# EasyEDA Pro project ProPrj_OASman SMD update_2025-02-10.epro

# Schematic Schematic1
Board Name: Board1; Create Date: 2025-02-08; Page Name: P1; Project Name: ProDoc_OASmanPCB_2025-02-07; Schematic Name: Schematic1; Update Date: 2025-02-07; Company: EasyEDA.com; Page Size: A4; Version: V1.0
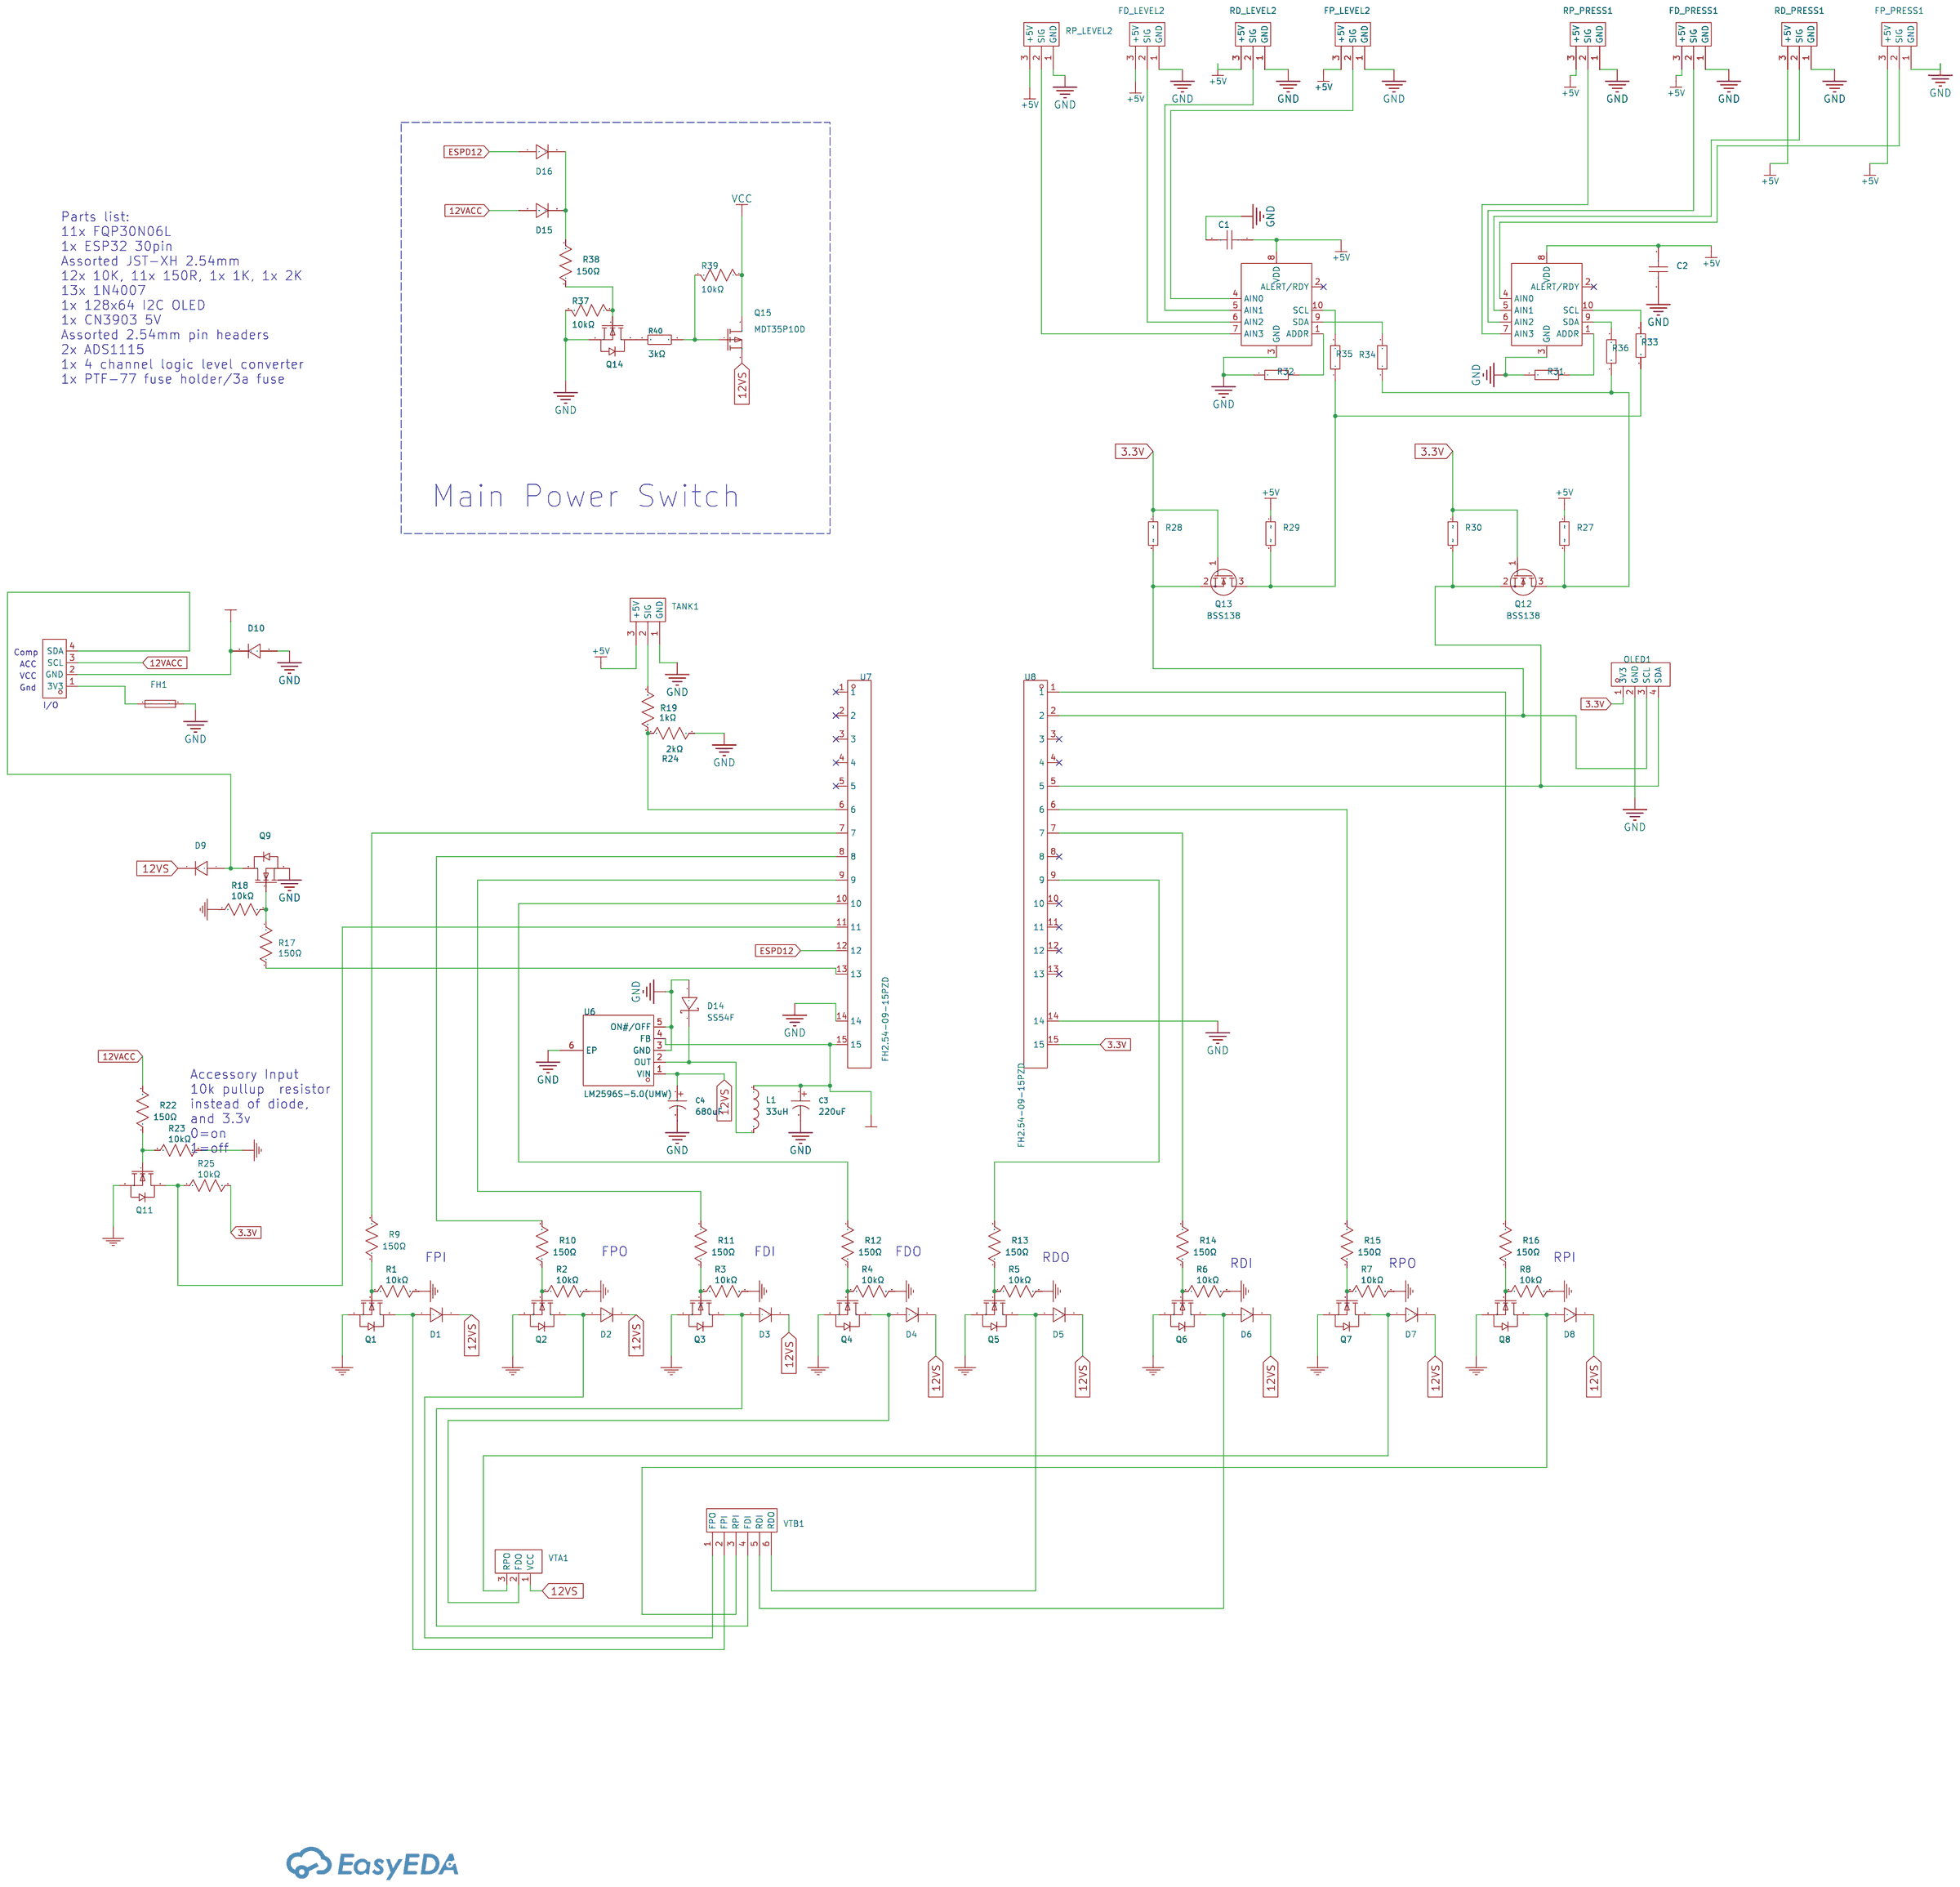
[diagram p0: schematic sheet]

## Parts
C1  1uF  [C0603]
C2  1uF  [C0603]
C3  220uF  [CAP-SMD_BD6.3-L6.6-W6.6-FD]
C4  680uF  [CAP-SMD_BD10.0-L10.3-W10.3-LS11.3-FD]
CN1  XH-4A绿色  [CONN-TH_XH-4A-1]
D1  1N4007  [SMA_L4.3-W2.5-LS5.0-RD]
D2  1N4007  [SMA_L4.3-W2.5-LS5.0-RD]
D3  1N4007  [SMA_L4.3-W2.5-LS5.0-RD]
D4  1N4007  [SMA_L4.3-W2.5-LS5.0-RD]
D5  1N4007  [SMA_L4.3-W2.5-LS5.0-RD]
D6  1N4007  [SMA_L4.3-W2.5-LS5.0-RD]
D7  1N4007  [SMA_L4.3-W2.5-LS5.0-RD]
D8  1N4007  [SMA_L4.3-W2.5-LS5.0-RD]
D9  1N4007  [SMA_L4.3-W2.5-LS5.0-RD]
D10  1N4007  [SMA_L4.3-W2.5-LS5.0-RD]
D14  SS54F  [SMAF_L3.5-W2.6-LS4.7-FD]
D15  1N4007  [SMA_L4.3-W2.5-LS5.0-RD]
D16  1N4007  [SMA_L4.3-W2.5-LS5.0-RD]
FD_LEVEL2  XH-3A  [CONN-TH_XH-3A]
FD_PRESS1  XH-3A  [CONN-TH_XH-3A]
FH1  PTF-77  [FUSE-TH_L24.4-W9.4-P22.60]
FP_LEVEL2  XH-3A  [CONN-TH_XH-3A]
FP_PRESS1  XH-3A  [CONN-TH_XH-3A]
L1  33uH  [IND-SMD_L10.8-W10.0_SLO1040H]
OLED1  XH-4A绿色  [CONN-TH_XH-4A-1]
Q1  MDT30N06L  [TO-252-2_L6.6-W5.6-P4.60-LS9.7-BR]
Q2  MDT30N06L  [TO-252-2_L6.6-W5.6-P4.60-LS9.7-BR]
Q3  MDT30N06L  [TO-252-2_L6.6-W5.6-P4.60-LS9.7-BR]
Q4  MDT30N06L  [TO-252-2_L6.6-W5.6-P4.60-LS9.7-BR]
Q5  MDT30N06L  [TO-252-2_L6.6-W5.6-P4.60-LS9.7-BR]
Q6  MDT30N06L  [TO-252-2_L6.6-W5.6-P4.60-LS9.7-BR]
Q7  MDT30N06L  [TO-252-2_L6.6-W5.6-P4.60-LS9.7-BR]
Q8  MDT30N06L  [TO-252-2_L6.6-W5.6-P4.60-LS9.7-BR]
Q9  MDT30N06L  [TO-252-2_L6.6-W5.6-P4.60-LS9.7-BR]
Q11  MDT30N06L  [TO-252-2_L6.6-W5.6-P4.60-LS9.7-BR]
Q12  BSS138  [PCM_Package_TO_SOT_SMD_AKL:SOT-23]
Q13  BSS138  [PCM_Package_TO_SOT_SMD_AKL:SOT-23]
Q14  MDT30N06L  [TO-252-2_L6.6-W5.6-P4.60-LS9.7-BR]
Q15  MDT35P10D  [TO-252-2_L6.6-W6.1-P4.57-LS9.9-BR-CW]
R1  10kΩ  [R1206]
R2  10kΩ  [R1206]
R3  10kΩ  [R1206]
R4  10kΩ  [R1206]
R5  10kΩ  [R1206]
R6  10kΩ  [R1206]
R7  10kΩ  [R1206]
R8  10kΩ  [R1206]
R9  150Ω  [R1206]
R10  150Ω  [R1206]
R11  150Ω  [R1206]
R12  150Ω  [R1206]
R13  150Ω  [R1206]
R14  150Ω  [R1206]
R15  150Ω  [R1206]
R16  150Ω  [R1206]
R17  150Ω  [R1206]
R18  10kΩ  [R1206]
R19  1kΩ  [R1206]
R22  150Ω  [R1206]
R23  10kΩ  [R1206]
R24  2kΩ  [R1206]
R25  10kΩ  [R1206]
R27  10k_0402  [Resistor_SMD:R_0402_1005Metric]
R28  10k_0402  [Resistor_SMD:R_0402_1005Metric]
R29  10k_0402  [Resistor_SMD:R_0402_1005Metric]
R30  10k_0402  [Resistor_SMD:R_0402_1005Metric]
R31  10K  [R0402]
R32  10K  [R0402]
R33  10K  [R0402]
R34  10K  [R0402]
R35  10K  [R0402]
R36  10K  [R0402]
R37  10kΩ  [R1206]
R38  150Ω  [R1206]
R39  10kΩ  [R1206]
R40  3kΩ  [R1206]
RD_LEVEL2  XH-3A  [CONN-TH_XH-3A]
RD_PRESS1  XH-3A  [CONN-TH_XH-3A]
RP_LEVEL2  XH-3A  [CONN-TH_XH-3A]
RP_PRESS1  XH-3A  [CONN-TH_XH-3A]
TANK1  XH-3A  [CONN-TH_XH-3A]
U4  ADS1115IDGSR  [MSOP-10_L3.0-W3.0-P0.50-LS5.0-BL]
U5  ADS1115IDGSR  [MSOP-10_L3.0-W3.0-P0.50-LS5.0-BL]
U6  LM2596S-5.0(UMW)  [TO-263-5_L10.2-W8.9-P1.70-BR]
U7  FH2.54-09-15PZD  [HDR-TH_15P-P2.54-V-F-1]
U8  FH2.54-09-15PZD  [HDR-TH_15P-P2.54-V-F-1]
VTA1  XH-3A  [CONN-TH_XH-3A]
VTB1  XH-6A  [CONN-TH_6P-P2.50_XH-6A]

## Library data of the parts
C1 C2 = GRM188R61H105KAALD: Capacitance: Tolerance:±10% Tolerance:±10% Voltage Rated: Temperature Coefficient:; LCSC Part Name: 1uF ±10% 50V; Supplier Part: C77386; Manufacturer: muRata(村田); Supplier Footprint: 0603; JLCPCB Part Class: Extended Part; Datasheet: https://atta.szlcsc.com/upload/public/pdf/source/20170116/1484561238855.pdf; Supplier: LCSC; Tolerance: ±10%
C3 = CK1C221M-CRE77: Capacitance: Tolerance:±20% Tolerance:±20% Rated Voltage: Ripple Current:- Equivalent Series Resistance(ESR):- φD: L: Lifetime @ Temp:2000hrs@105℃ Operating Temperature:-40℃~+105℃ Operating Temperature:-40℃~+105℃; LCSC Part Name: 220uF ±20% 16V; Supplier Part: C131158; Manufacturer: ST(先科); Supplier Footprint: SMD,D6.3xL7.7mm; JLCPCB Part Class: Extended Part; Datasheet: https://atta.szlcsc.com/upload/public/pdf/source/20180511/C191812_AFB6060B7C8A92684C0DBB73273612B6.pdf; Supplier: LCSC; Tolerance: ±20%; Lifetime @ Temp: 2000hrs@105℃; Operating Temperature: -40℃~+105℃
C4 = VT1E681M1013: Capacitance: Tolerance:±20% Tolerance:±20% Rated Voltage: Ripple Current:- Equivalent Series Resistance(ESR):- φD: L: Lifetime @ Temp:2000hrs@105℃ Operating Temperature:-40℃~+105℃ Operating Temperature:-40℃~+105℃; LCSC Part Name: 680uF ±20% 25V; Supplier Part: C50456; Manufacturer: HONOR(荣誉); JLCPCB Part Class: Extended Part; Datasheet: https://atta.szlcsc.com/upload/public/pdf/source/20210105/C50456_AB267C092744AC1CDEAFE23B9B6DBFA0.pdf; Supplier: LCSC; Tolerance: ±20%; Lifetime @ Temp: 2000hrs@105℃; Operating Temperature: -40℃~+105℃
CN1 OLED1 = XH-4A绿色: Pins Structure:1x4P Pitch:- Mounting Style:- Reference Series:XH Number of Pins:4P Number of Rows:1 Number of PINs Per Row:4 Row Spacing:- Contact Material:-; LCSC Part Name: 1x4P 系列:XH; Supplier Part: C192885; Manufacturer: BOOMELE(博穆精密); Supplier Footprint: 插件,P=2.5mm; JLCPCB Part Class: Extended Part; Supplier: LCSC; Pins Structure: 1x4P; Reference Series: XH; Number of Pins: 4P; Number of Rows: 1; Number of PINs Per Row: 4
D1-D10 D15 D16 = 1N4007_C727081: Diode Configuration:Independent Type Forward Voltage (Vf@If):1.1V@1A Reverse Voltage (Vr): Rectified Current: Reverse Leakage Current (Ir):5uA; Supplier Part: C727081; Manufacturer: TWGMC(台湾迪嘉); Supplier Footprint: SMA(DO-214AC); JLCPCB Part Class: Extended Part; Datasheet: https://atta.szlcsc.com/upload/public/pdf/source/20200828/C727079_3A05254382567072883400655AE0ED46.pdf; Supplier: LCSC; Diode Configuration: Independent Type; Forward Voltage (Vf@If): 1.1V@1A; Reverse Leakage Current (Ir): 5uA
D14 = SS54F_C524830: Diode Configuration:Single Forward Voltage (Vf@If):550mV@5A Reverse Voltage (Vr):40V Average Rectified Current (Io):5A Reverse Leakage Current (Ir):500uA@40V; LCSC Part Name: 电压:40V 电流:5A; Supplier Part: C524830; Manufacturer: High Diode(海德); Supplier Footprint: SMAF; JLCPCB Part Class: Extended Part; Datasheet: https://atta.szlcsc.com/upload/public/pdf/source/20191203/C466492_9442A9360C1C4CFA388C0BFD5F2F9ABE.pdf; Supplier: LCSC; Diode Configuration: Single; Forward Voltage (Vf@If): 550mV@5A; Reverse Voltage (Vr): 40V; Average Rectified Current (Io): 5A; Reverse Leakage Current (Ir): 500uA@40V
FD_LEVEL2 FD_PRESS1 FP_LEVEL2 FP_PRESS1 RD_LEVEL2 RD_PRESS1 RP_LEVEL2 RP_PRESS1 TANK1 VTA1 = XH-3A_C2316: Pins Structure:1x3P Pitch:2.5mm Mounting Style:- Reference Series:XH Number of Pins:3P Number of Rows:1 Number of PINs Per Row:3 Row Spacing:- Contact Material:-; LCSC Part Name: 1x3P 间距:2.5mm 系列:XH; Supplier Part: C2316; Manufacturer: BOOMELE(博穆精密); Supplier Footprint: 插件,P=2.5mm; JLCPCB Part Class: Extended Part; Datasheet: https://atta.szlcsc.com/upload/public/pdf/source/20151222/1457707654251.pdf; Supplier: LCSC; Pins Structure: 1x3P; Pitch: 2.5mm; Reference Series: XH; Number of Pins: 3P; Number of Rows: 1; Number of PINs Per Row: 3
FH1 = PTF-77: Fuseholder Type:- Voltage Rating:250V Current Rating:10A Fuse Type:- Fuse Size:-; LCSC Part Name: 保险丝座 5x20mm 绿色 2件套; Supplier Part: C717030; Manufacturer: XFCN(兴飞); JLCPCB Part Class: Extended Part; Datasheet: https://atta.szlcsc.com/upload/public/pdf/source/20241204/2C5BCE3FA349D3ADCF55CB0838B92C4A.pdf; Supplier: LCSC; Voltage Rating: 250V; Current Rating: 10A
L1 = SLO1040H330MTT: Inductance: Tolerance:±20% Tolerance:±20% Rated Current: DC Resistance (DCR):; LCSC Part Name: 33uH ±20%; Supplier Part: C182163; Manufacturer: Sunltech(韩国顺磁); Supplier Footprint: SMD; JLCPCB Part Class: Extended Part; Datasheet: https://atta.szlcsc.com/upload/public/pdf/source/20201009/C207854_ACA4210DD273ACBB198904FC5A3A8806.pdf; Supplier: LCSC; Tolerance: ±20%
Q1-Q9 Q11 Q14 = MDT30N06L: Type:1 N-channel Drain Source Voltage (Vdss):60V Continuous Drain Current (Id): Drain Source On Resistance (RDS(on)@Vgs,Id):40mΩ@4.5V Power Dissipation (Pd): Gate Threshold Voltage (Vgs(th)@Id):1.8V@250uA Total Gate Charge (Qg@Vgs):21nC@10V Input Capacita; LCSC Part Name: 1个N沟道 耐压:60V 电流:30A; Supplier Part: C5240683; Manufacturer: minos(迈诺斯); Supplier Footprint: TO-252-2L; JLCPCB Part Class: Extended Part; Datasheet: https://atta.szlcsc.com/upload/public/pdf/source/20240829/EA64E09E95BF58FCAC7BF20D9AEBC519.pdf; Supplier: LCSC; Type: 1 N-channel; Drain Source Voltage (Vdss): 60V; Drain Source On Resistance (RDS(on)@Vgs,Id): 40mΩ@4.5V; Gate Threshold Voltage (Vgs(th)@Id): 1.8V@250uA; Total Gate Charge (Qg@Vgs): 21nC@10V; Input Capacitance (Ciss@Vds): 670pF; Reverse Transfer Capacitance (Crss@Vds): 66pF; Operating Temperature: -55℃~+175℃
Q12 Q13 = PCM_Transistor_MOSFET_AKL_BSS138: SOT-23 N-MOSFET enchancement mode transistor, 50V, 200mA, 300mW, Alternate KiCAD Library; User doc link: https://www.tme.eu/Document/2b32cdd3c66afedbcd628e73d93ae817/BSS138-7-F.pdf
Q15 = MDT35P10D: Type:1 Piece P-Channel Drain Source Voltage (Vdss): Continuous Drain Current (Id): Drain Source On Resistance (RDS(on)@Vgs,Id):26mΩ@10V,15A Power Dissipation (Pd): Gate Threshold Voltage (Vgs(th)@Id):2V@250uA Total Gate Charge (Qg@Vgs):40nC@10V Input Capa; LCSC Part Name: 1个P沟道 耐压:100V 电流:35A; Supplier Part: C5890267; Manufacturer: minos(迈诺斯); Supplier Footprint: TO252; JLCPCB Part Class: Extended Part; Datasheet: https://atta.szlcsc.com/upload/public/pdf/source/20230704/A90682651C9529CA52851179CB8911E0.pdf; Supplier: LCSC; Type: 1 Piece P-Channel; Drain Source On Resistance (RDS(on)@Vgs,Id): 26mΩ@10V,15A; Gate Threshold Voltage (Vgs(th)@Id): 2V@250uA; Total Gate Charge (Qg@Vgs): 40nC@10V; Input Capacitance (Ciss@Vds): 2.315nF@25V; Reverse Transfer Capacitance (Crss@Vds): 11pF@25V
R1-R8 R18 R23 R25 R37 R39 = 1206W4F1002T5E: Type:Thick Film Resistors Resistance:10kΩ Tolerance:±1% Tolerance:±1% Power(Watts): Overload Voltage (Max): Temperature Coefficient:±100ppm/℃ Temperature Coefficient:±100ppm/℃ Operating Temperature Range:-55℃~+155℃ Operating Temperature Range:-55℃~+155℃; LCSC Part Name: 10kΩ ±1% 250mW 厚膜电阻; Supplier Part: C17902; Manufacturer: UNI-ROYAL(厚声); Supplier Footprint: 1206; JLCPCB Part Class: Basic Part; Datasheet: https://atta.szlcsc.com/upload/public/pdf/source/20200306/C422600_1E6D84923E4A46A82E41ADD87F860B5C.pdf; Supplier: LCSC; Type: Thick Film Resistors; Tolerance: ±1%; Temperature Coefficient: ±100ppm/℃; Operating Temperature Range: -55℃~+155℃
R9-R17 R22 R38 = 1206W4F1500T5E: Type:Thick Film Resistors Resistance: Tolerance:±1% Tolerance:±1% Power(Watts): Overload Voltage (Max): Temperature Coefficient:±100ppm/℃ Temperature Coefficient:±100ppm/℃ Operating Temperature Range:-55℃~+155℃ Operating Temperature Range:-55℃~+155℃; LCSC Part Name: 150Ω ±1% 250mW 厚膜电阻; Supplier Part: C17917; Manufacturer: UNI-ROYAL(厚声); Supplier Footprint: 1206; JLCPCB Part Class: Extended Part; Datasheet: https://atta.szlcsc.com/upload/public/pdf/source/20200306/C422600_1E6D84923E4A46A82E41ADD87F860B5C.pdf; Supplier: LCSC; Type: Thick Film Resistors; Tolerance: ±1%; Temperature Coefficient: ±100ppm/℃; Operating Temperature Range: -55℃~+155℃
R19 = 1206W4F1001T5E_C4410: Type:Thick Film Resistors Resistance:1kΩ Tolerance:±1% Tolerance:±1% Power(Watts): Overload Voltage (Max): Operating Temperature Range:-55℃~+155℃ Operating Temperature Range:-55℃~+155℃; LCSC Part Name: 1kΩ ±1% 250mW 厚膜电阻; Supplier Part: C4410; Manufacturer: UNI-ROYAL(厚声); Manufacturer Part: 1206W4F1001T5E; Supplier Footprint: 1206; JLCPCB Part Class: Basic Part; Datasheet: https://atta.szlcsc.com/upload/public/pdf/source/20200306/C422600_1E6D84923E4A46A82E41ADD87F860B5C.pdf; Supplier: LCSC; Type: Thick Film Resistors; Tolerance: ±1%; Operating Temperature Range: -55℃~+155℃
R24 = 1206W4F2001T5E: Type:Thick Film Resistors Resistance:2kΩ Tolerance:±1% Tolerance:±1% Power(Watts): Overload Voltage (Max): Temperature Coefficient:±100ppm/℃ Temperature Coefficient:±100ppm/℃ Operating Temperature Range:-55℃~+155℃ Operating Temperature Range:-55℃~+155℃; LCSC Part Name: 2kΩ ±1% 250mW 厚膜电阻; Supplier Part: C17944; Manufacturer: UNI-ROYAL(厚声); Supplier Footprint: 1206; JLCPCB Part Class: Basic Part; Datasheet: https://atta.szlcsc.com/upload/public/pdf/source/20200306/C422600_1E6D84923E4A46A82E41ADD87F860B5C.pdf; Supplier: LCSC; Type: Thick Film Resistors; Tolerance: ±1%; Temperature Coefficient: ±100ppm/℃; Operating Temperature Range: -55℃~+155℃
R27-R30 = PCM_4ms_Resistor_10k_0402: 10k, 1%, 1/16W, 0603; Specifications: 10k, 1%, 1/10W, 0402; Manufacturer: Yageo; Part Number: RT0402FRE0710KL; Display: 10k; Manufacturer 2: Yageo; Part Number 2: RT0402DRE0710KL
R31-R36 = Res_0402: Supplier Footprint: 0402
R40 = 1206W4F3001T5E: Type:Thick Film Resistors Resistance:3kΩ Tolerance:±1% Tolerance:±1% Power(Watts): Overload Voltage (Max): Temperature Coefficient:±100ppm/℃ Temperature Coefficient:±100ppm/℃ Operating Temperature Range:-55℃~+155℃ Operating Temperature Range:-55℃~+155℃; LCSC Part Name: 3kΩ ±1% 250mW 厚膜电阻; Supplier Part: C18012; Manufacturer: UNI-ROYAL(厚声); Supplier Footprint: 1206; JLCPCB Part Class: Extended Part; Datasheet: https://atta.szlcsc.com/upload/public/pdf/source/20200306/C422600_1E6D84923E4A46A82E41ADD87F860B5C.pdf; Supplier: LCSC; Type: Thick Film Resistors; Tolerance: ±1%; Temperature Coefficient: ±100ppm/℃; Operating Temperature Range: -55℃~+155℃
U4 U5 = ADS1115IDGSR: Interface:I2C differential input:Yes number of channels:2 Supply Voltage:2V~5.5V Supply Voltage:2V~5.5V sampling frequency:860Hz resolution:16Bit Operating Temperature:-40℃~+125℃ Operating Temperature:-40℃~+125℃; LCSC Part Name: 具有内部基准、振荡器和可编程比较器且兼容 I2C 的ADS111x、超小型、低功耗 860SPS、16位ADC; Supplier Part: C37593; Manufacturer: TI(德州仪器); Supplier Footprint: VSSOP-10; JLCPCB Part Class: Extended Part; Datasheet: https://www.ti.com/cn/lit/gpn/ads1115; Supplier: LCSC; Interface: I2C; differential input: Yes; number of channels: 2; Supply Voltage: 2V~5.5V; sampling frequency: 860Hz; resolution: 16Bit; Operating Temperature: -40℃~+125℃
U6 = LM2596S-5.0(UMW): Function:Step-down type Output Type:Fixed Input Voltage:7V~40V Input Voltage:7V~40V Output Voltage:5V Output Voltage:5V Output Current:3A Switching Frequency:150kHz Switching Frequency:150kHz Operating Temperature:-40℃~+125℃@(TA) Operating Temperature:-40; LCSC Part Name: 3A降压稳压器; Supplier Part: C347421; Manufacturer: UMW(友台半导体); Supplier Footprint: TO-263-5; JLCPCB Part Class: Extended Part; Datasheet: https://atta.szlcsc.com/upload/public/pdf/source/20241113/7515F50B4FEE0270D4DE7078364C87FA.pdf; Supplier: LCSC; Function: Step-down type; Output Type: Fixed; Input Voltage: 7V~40V; Output Voltage: 5V; Output Current: 3A; Switching Frequency: 150kHz; Operating Temperature: -40℃~+125℃@(TA); Synchronous Rectification: No; Number of Outputs: 1; Topology: Step-down; Quiescent Current (Iq): 80uA; Switch tube (built-in/external): Built-in
U7 U8 = FH2.54-09-15PZD: Supplier Part: C7500782; Manufacturer: XUNPU(讯普); Supplier Footprint: 插件,P=2.54mm; JLCPCB Part Class: Extended Part; Datasheet: https://atta.szlcsc.com/upload/public/pdf/source/20230809/12C46BEDB70740F4680EB1129D481D12.pdf; Supplier: LCSC
VTB1 = XH-6A_C5663: Pins Structure:1x6P Pitch:2.5mm Mounting Style:- Reference Series:XH Number of Pins:6P Number of Rows:1 Number of PINs Per Row:6 Row Spacing:- Contact Material:-; LCSC Part Name: 系列:XH 间距:2.5mm 1x6P; Supplier Part: C5663; Manufacturer: BOOMELE(博穆精密); Supplier Footprint: 插件,P=2.5mm; JLCPCB Part Class: Extended Part; Datasheet: https://atta.szlcsc.com/upload/public/pdf/source/20151222/1457707654251.pdf; Supplier: LCSC; Pins Structure: 1x6P; Pitch: 2.5mm; Reference Series: XH; Number of Pins: 6P; Number of Rows: 1; Number of PINs Per Row: 6

## Nets
3.3V: OLED1.1(3V3) Q12.1(G) Q13.1(G) R25.2 R28.1 R30.1 U8.15
12VACC: CN1.3(SCL) D15.1(A) R22.2
12VS: C4.1 D1.2(K) D2.2(K) D3.2(K) D4.2(K) D5.2(K) D6.2(K) D7.2(K) D8.2(K) D9.2(K) Q15.3(S) U6.1(VIN) VTA1.1(VCC)
+5V: C1.1 C2.1 C3.1 FD_LEVEL2.3(+5V) FD_PRESS1.3(+5V) FP_LEVEL2.3(+5V) FP_PRESS1.3(+5V) L1.1 R27.1 R29.1 RD_LEVEL2.3(+5V) RD_PRESS1.3(+5V) RP_LEVEL2.3(+5V) RP_PRESS1.3(+5V) TANK1.3(+5V) U4.8(VDD) U5.8(VDD) U6.4(FB) U7.15
GND: C1.2 C2.2 C3.2 C4.2 D10.1(A) D14.1(A) FD_LEVEL2.1(GND) FD_PRESS1.1(GND) FH1.2 FP_LEVEL2.1(GND) FP_PRESS1.1(GND) OLED1.2(GND) Q1.3(S) Q2.3(S) Q3.3(S) Q4.3(S) Q5.3(S) Q6.3(S) Q7.3(S) Q8.3(S) Q9.3(S) Q11.3(S) Q14.3(S) R1.2 R2.2 R3.2 R4.2 R5.2 R6.2 R7.2 R8.2 R18.2 R23.2 R24.1 R31.1 R32.1 R37.2 RD_LEVEL2.1(GND) RD_PRESS1.1(GND) RP_LEVEL2.1(GND) RP_PRESS1.1(GND) TANK1.1(GND) U4.3(GND) U5.3(GND) U6.3(GND) U6.5(ON#/OFF) U6.6(EP) U7.14 U8.14
VCC: CN1.2(GND) D10.2(K) Q15.2(D) R39.1
ESPD12: D16.1(A) U7.12
$1N4350: Q8.1(G) R8.1 R16.1
$1N4351: Q7.1(G) R7.1 R15.1
$1N4352: Q6.1(G) R6.1 R14.1
$1N4353: Q5.1(G) R5.1 R13.1
$1N4354: Q4.1(G) R4.1 R12.1
$1N4355: Q3.1(G) R3.1 R11.1
$1N4356: Q2.1(G) R2.1 R10.1
$1N4357: Q1.1(G) R1.1 R9.1
$1N4371: D4.1(A) Q4.2(D) VTA1.2(FDO)
$1N4376: Q9.1(G) R17.1 R18.1
$1N4377: R10.2 U7.8
$1N4378: R11.2 U7.9
$1N4379: CN1.4(SDA) D9.1(A) Q9.2(D)
$1N4380: R13.2 U8.9
$1N4381: R14.2 U8.7
$1N4382: R19.2 TANK1.2(SIG)
$1N4383: R19.1 R24.2 U7.6
$1N4386: CN1.1(3V3) FH1.1
$1N4403: FD_LEVEL2.2(SIG) U4.6(AIN2)
$1N4407: FP_LEVEL2.2(SIG) U4.4(AIN0)
$1N4413: RD_LEVEL2.2(SIG) U4.5(AIN1)
$1N4416: RD_PRESS1.2(SIG) U5.5(AIN1)
$1N4423: RP_LEVEL2.2(SIG) U4.7(AIN3)
$1N4424: FD_PRESS1.2(SIG) U5.6(AIN2)
$1N4428: RP_PRESS1.2(SIG) U5.7(AIN3)
$1N4434: Q11.2(D) R25.1 U7.11
$1N4435: R17.2 U7.13
$1N4436: R16.2 U8.1
$1N4438: R9.2 U7.7
$1N4442: R15.2 U8.6
$1N4443: FP_PRESS1.2(SIG) U5.4(AIN0)
$1N4444: R31.2 U5.1(ADDR)
$1N4446: R32.2 U4.1(ADDR)
$1N4448: R33.2 U5.10(SCL)
$1N4449: R34.2 U4.9(SDA)
$1N4451: R35.2 U4.10(SCL)
$1N4452: R36.2 U5.9(SDA)
$1N4455: Q11.1(G) R22.1 R23.1
$1N4460: R12.2 U7.10
$1N4462: D14.2(K) L1.2 U6.2(OUT)
$1N4475: Q14.2(D) R40.1
$1N4476: Q15.1(G) R39.2 R40.2
$1N4478: Q14.1(G) R37.1 R38.1
$1N4479: D15.2(K) D16.2(K) R38.2
$1N4481: D7.1(A) Q7.2(D) VTA1.3(RPO)
Net-(D1-1): D1.1(A) Q1.2(D) VTB1.2(FPI)
Net-(D2-1): D2.1(A) Q2.2(D) VTB1.1(FPO)
Net-(D3-1): D3.1(A) Q3.2(D) VTB1.4(FDI)
Net-(D5-1): D5.1(A) Q5.2(D) VTB1.6(RDO)
Net-(D6-1): D6.1(A) Q6.2(D) VTB1.5(RDI)
Net-(D8-1): D8.1(A) Q8.2(D) VTB1.3(RPI)
Net-(OLED1-3): OLED1.3(SCL) Q13.2(S) R28.2 U8.2
Net-(OLED1-4): OLED1.4(SDA) Q12.2(S) R30.2 U8.5
Net-(Q12-3): Q12.3(D) R27.2 R34.1 R36.1
Net-(Q13-3): Q13.3(D) R29.2 R33.1 R35.1

Not connected (* = marked no-connect by the designer): U4 2(ALERT/RDY)*; U5 2(ALERT/RDY)*; U7 1* 2* 3* 4* 5*; U8 3* 4* 8* 10* 11* 12* 13*

## Notes on the sheet
- Parts list:
  11x FQP30N06L
  1x ESP32 30pin
  Assorted JST-XH 2.54mm
  12x 10K, 11x 150R, 1x 1K, 1x 2K
  13x 1N4007
  1x 128x64 I2C OLED
  1x CN3903 5V
  Assorted 2.54mm pin headers
  2x ADS1115
  1x 4 channel logic level converter
  1x PTF-77 fuse holder/3a fuse
- Main Power Switch
- Comp
- ACC
- VCC
- Gnd
- I/O
- Accessory Input
  10k pullup  resistor
  instead of diode,
  and 3.3v
  0=on
  1=off
- FPI
- FPO
- FDI
- FDO
- RDO
- RPI
- RDI
- RPO

# Board PCB1
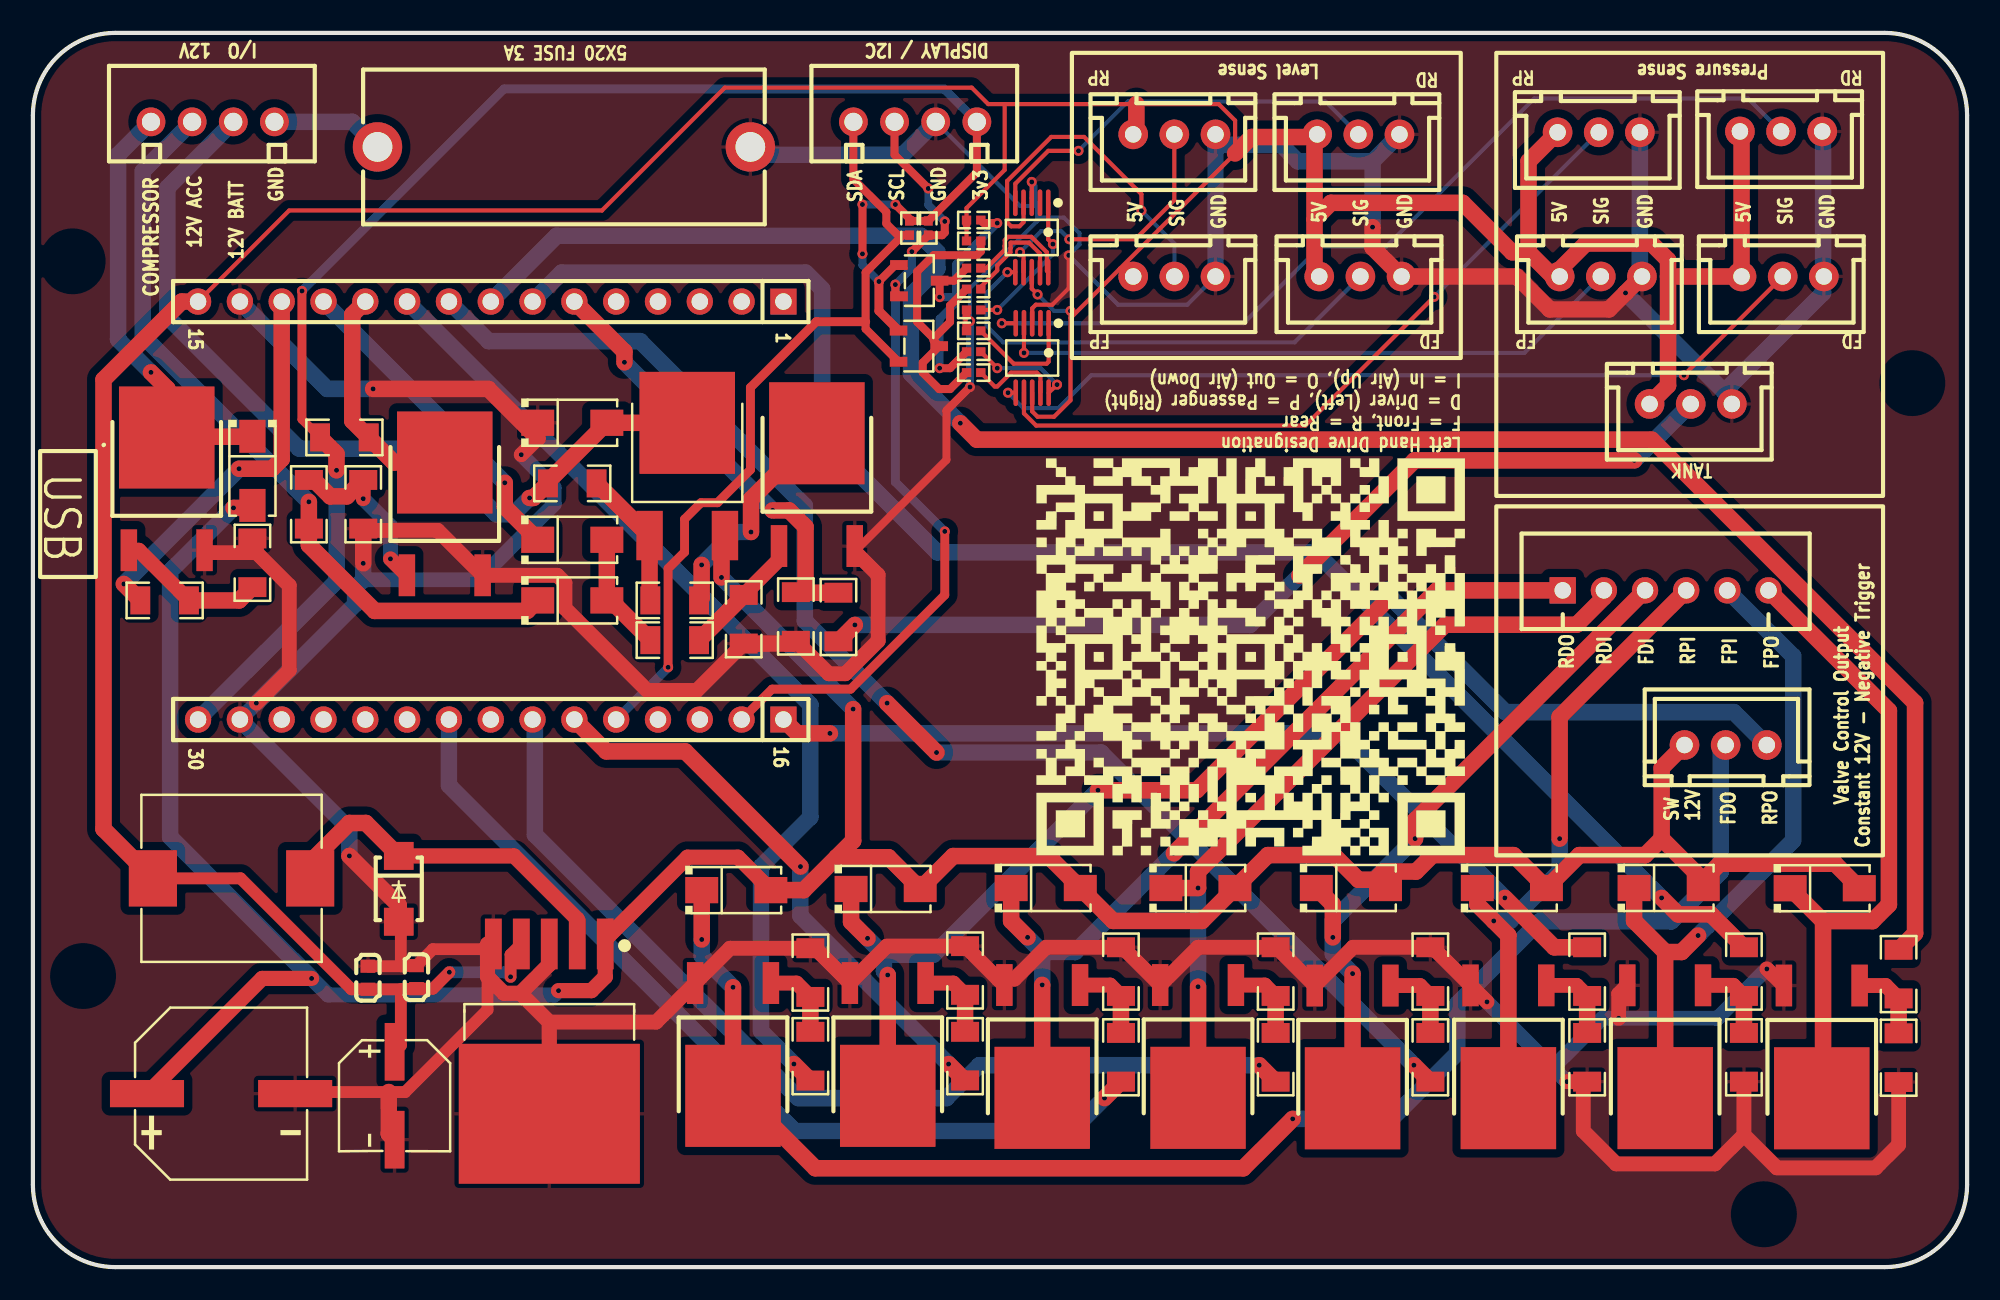
[diagram p1: board, top side]
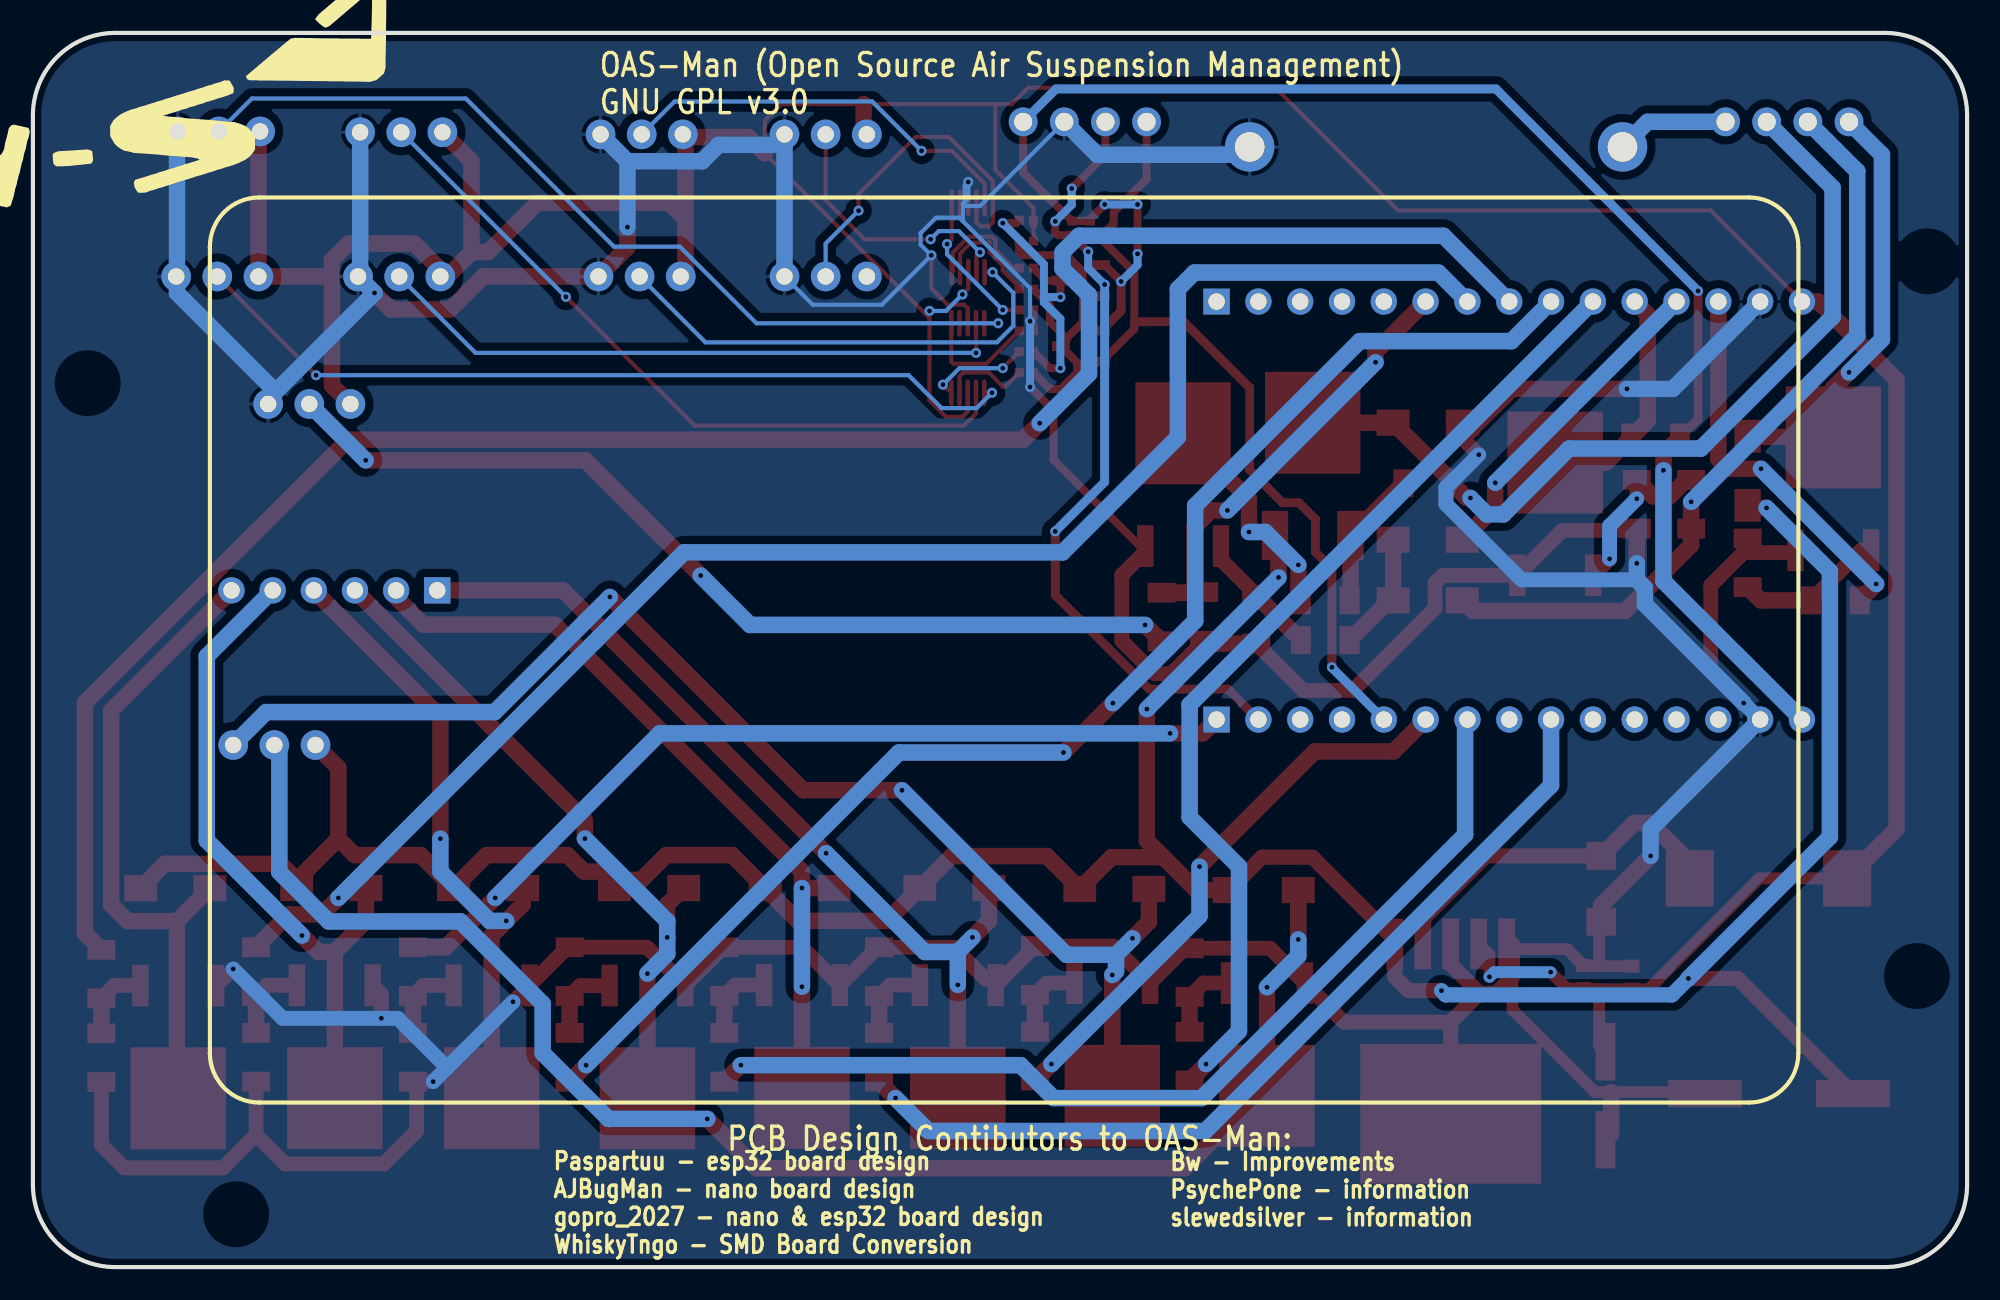
[diagram p2: board, bottom side, seen from below]

Outline 117.5 x 75 mm; copper layers: Top Layer, Bottom Layer. Coordinates in mm from the lower left corner of the outline.
Outline path: 0,70 0,5 arc(1.46,1.46) 5,0 112.5,0 arc(116.04,1.46) 117.5,5 117.5,70 arc(116.04,73.54) 112.5,75 5,75 arc(1.46,73.54) 0,70
Stack: Top Layer 0.035mm / Dielectric1 1.51mm FR4 er 4.5 / Bottom Layer 0.035mm

## Design rules (mm)
template: Custom Config
spacing copperThickness1oz (default): track to track 0.102, other pairs 0.152 to 0.3
spacing copperThickness2oz: track to track 0.203, other pairs 0.152 to 0.3
track width copperThickness1oz (default): min 0.127, default 1, max 2.54
track width copperThickness2oz: min 0.203, default 0.254, max 2.54
differential pair differentialPair (default): width min 0.127, default 0.254, max 2.54; gap min 0.152, default 0.152
via viaSize (default): diameter min 0.5, default 0.61, max 10; hole min 0.3, default 0.305, max 6.3

## Placement (name value [footprint] x y rotation side)
C1  1uF  [C0603]  23.3 17.62 90 top
C2  1uF  [C0603]  20.35 17.58 90 top
C3  220uF  [CAP-SMD_BD6.3-L6.6-W6.6-FD]  21.97 10.41 270 top
C4  680uF  [CAP-SMD_BD10.0-L10.3-W10.3-LS11.3-FD]  11.43 10.54 0 top
CN1  XH-4A绿色  [CONN-TH_XH-4A-1]  10.92 69.6 180 top
D1  1N4007  [SMA_L4.3-W2.5-LS5.0-RD]  99.37 23.04 0 top
D2  1N4007  [SMA_L4.3-W2.5-LS5.0-RD]  108.85 23.02 0 top
D3  1N4007  [SMA_L4.3-W2.5-LS5.0-RD]  80.07 23.04 0 top
D4  1N4007  [SMA_L4.3-W2.5-LS5.0-RD]  42.73 22.91 0 top
D5  1N4007  [SMA_L4.3-W2.5-LS5.0-RD]  61.53 23.04 0 top
D6  1N4007  [SMA_L4.3-W2.5-LS5.0-RD]  70.92 23.04 0 top
D7  1N4007  [SMA_L4.3-W2.5-LS5.0-RD]  51.8 22.98 0 top
D8  1N4007  [SMA_L4.3-W2.5-LS5.0-RD]  89.85 23.04 0 top
D9  1N4007  [SMA_L4.3-W2.5-LS5.0-RD]  13.33 48.39 270 top
D10  1N4007  [SMA_L4.3-W2.5-LS5.0-RD]  32.77 51.31 0 top
D14  SS54F  [SMAF_L3.5-W2.6-LS4.7-FD]  22.22 22.99 90 top
D15  1N4007  [SMA_L4.3-W2.5-LS5.0-RD]  32.77 40.51 0 top
D16  1N4007  [SMA_L4.3-W2.5-LS5.0-RD]  32.77 44.2 0 top
FD_LEVEL2  XH-3A  [CONN-TH_XH-3A]  80.65 60.2 180 top
FD_PRESS1  XH-3A  [CONN-TH_XH-3A]  106.3 60.2 180 top
FH1  PTF-77  [FUSE-TH_L24.4-W9.4-P22.60]  32.26 68.07 0 top
FP_LEVEL2  XH-3A  [CONN-TH_XH-3A]  69.34 60.2 180 top
FP_PRESS1  XH-3A  [CONN-TH_XH-3A]  95.25 60.2 180 top
L1  33uH  [IND-SMD_L10.8-W10.0_SLO1040H]  12.06 23.62 180 top
OLED1  XH-4A绿色  [CONN-TH_XH-4A-1]  53.59 69.6 180 top
Q1  MDT30N06L  [TO-252-2_L6.6-W5.6-P4.60-LS9.7-BR]  99.16 13.7 90 top
Q2  MDT30N06L  [TO-252-2_L6.6-W5.6-P4.60-LS9.7-BR]  108.67 13.68 90 top
Q3  MDT30N06L  [TO-252-2_L6.6-W5.6-P4.60-LS9.7-BR]  80.17 13.68 90 top
Q4  MDT30N06L  [TO-252-2_L6.6-W5.6-P4.60-LS9.7-BR]  42.53 13.83 90 top
Q5  MDT30N06L  [TO-252-2_L6.6-W5.6-P4.60-LS9.7-BR]  61.31 13.71 90 top
Q6  MDT30N06L  [TO-252-2_L6.6-W5.6-P4.60-LS9.7-BR]  70.78 13.71 90 top
Q7  MDT30N06L  [TO-252-2_L6.6-W5.6-P4.60-LS9.7-BR]  51.93 13.83 90 top
Q8  MDT30N06L  [TO-252-2_L6.6-W5.6-P4.60-LS9.7-BR]  89.63 13.69 90 top
Q9  MDT30N06L  [TO-252-2_L6.6-W5.6-P4.60-LS9.7-BR]  8.13 46.99 270 top
Q11  MDT30N06L  [TO-252-2_L6.6-W5.6-P4.60-LS9.7-BR]  25.02 45.47 270 top
Q14  MDT30N06L  [TO-252-2_L6.6-W5.6-P4.60-LS9.7-BR]  47.62 47.24 270 top
Q15  MDT35P10D  [TO-252-2_L6.6-W6.1-P4.57-LS9.9-BR-CW]  39.75 47.88 270 top
Q16  BSS138  [SOT-23-3_L2.9-W1.6-P1.90-LS2.8-BR]  53.82 55.96 180 top
Q17  BSS138  [SOT-23-3_L2.9-W1.6-P1.90-LS2.8-BR]  53.85 59.94 180 top
R1  10kΩ  [R1206]  103.94 12.75 270 top
R2  10kΩ  [R1206]  113.34 12.72 270 top
R3  10kΩ  [R1206]  84.89 17.96 90 top
R4  10kΩ  [R1206]  47.23 17.9 90 top
R5  10kΩ  [R1206]  66.1 17.96 90 top
R6  10kΩ  [R1206]  75.5 17.96 90 top
R7  10kΩ  [R1206]  56.63 18.02 90 top
R8  10kΩ  [R1206]  94.42 12.75 270 top
R9  150Ω  [R1206]  103.94 17.96 90 top
R10  150Ω  [R1206]  113.34 17.8 90 top
R11  150Ω  [R1206]  84.89 12.75 270 top
R12  150Ω  [R1206]  47.23 12.82 270 top
R13  150Ω  [R1206]  66.1 12.75 270 top
R14  150Ω  [R1206]  75.5 12.75 270 top
R15  150Ω  [R1206]  56.63 12.82 270 top
R16  150Ω  [R1206]  94.42 17.96 90 top
R17  150Ω  [R1206]  8 40.51 180 top
R18  10kΩ  [R1206]  13.33 42.8 90 top
R19  1kΩ  [R1206]  48.94 39.5 270 top
R22  150Ω  [R1206]  16.76 46.36 270 top
R23  10kΩ  [R1206]  20.07 46.36 270 top
R24  2kΩ  [R1206]  46.35 39.54 90 top
R25  10kΩ  [R1206]  18.92 50.42 180 top
R26  10kΩ  [R0402]  54.39 63.14 270 top
R27  10k_0402  [R0402]  53.25 63.14 270 top
R28  10k_0402  [R0402]  57.15 63.63 0 top
R29  10k_0402  [R0402]  57.15 62.36 0 top
R31  10K  [R0402]  57.15 56.9 0 top
R32  10K  [R0402]  57.15 58.17 0 top
R33  10K  [R0402]  57.15 55.63 0 top
R34  10K  [R0402]  57.15 59.44 0 top
R35  10K  [R0402]  57.15 60.71 0 top
R36  10K  [R0402]  57.15 54.36 0 top
R37  10kΩ  [R1206]  43.18 39.37 270 top
R38  150Ω  [R1206]  38.99 38.1 180 top
R39  10kΩ  [R1206]  32.77 47.62 0 top
R40  3kΩ  [R1206]  38.99 40.51 180 top
RD_LEVEL2  XH-3A  [CONN-TH_XH-3A]  80.52 68.83 180 top
RD_PRESS1  XH-3A  [CONN-TH_XH-3A]  106.2 69.01 180 top
RP_LEVEL2  XH-3A  [CONN-TH_XH-3A]  69.34 68.83 180 top
RP_PRESS1  XH-3A  [CONN-TH_XH-3A]  95.12 68.96 180 top
TANK1  XH-3A  [CONN-TH_XH-3A]  100.71 52.45 180 top
U4  ADS1115IDGSR  [MSOP-10_L3.0-W3.0-P0.50-LS5.0-BL]  60.68 62.57 180 top
U5  ADS1115IDGSR  [MSOP-10_L3.0-W3.0-P0.50-LS5.0-BL]  60.71 55.25 180 top
U6  LM2596S-5.0(UMW)  [TO-263-5_L10.2-W8.9-P1.70-BR]  31.37 14.48 90 top
U7  FH2.54-09-15PZD  [HDR-TH_15P-P2.54-V-F-1]  27.81 58.67 180 top
U8  FH2.54-09-15PZD  [HDR-TH_15P-P2.54-V-F-1]  27.81 33.27 180 top
VTA1  XH-3A  [CONN-TH_XH-3A]  102.83 31.73 0 top
VTB1  XH-6A  [CONN-TH_6P-P2.50_XH-6A]  99.15 41.12 180 top

## Footprints (pads in the part's own frame, mm; a bottom-side part is the same pattern mirrored in y, then rotated)
C0603
  rect 0.8x0.9 smd: 1(-0.7,0) 2(0.7,0)
CAP-SMD_BD6.3-L6.6-W6.6-FD
  rect 3.5x1.2 smd: 1(-2.67,0) 2(2.67,0)
CAP-SMD_BD10.0-L10.3-W10.3-LS11.3-FD
  rect 4.5x1.65 smd: 1(-4.5,0) 2(4.5,0)
CONN-TH_6P-P2.50_XH-6A
  rect 1.6x1.6 hole 1: 1(6.213,0)
  round 1.6 hole 1: 2(3.713,0) 3(1.214,0) 4(-1.286,0) 5(-3.787,0) 6(-6.287,0)
CONN-TH_XH-3A
  round 1.8 hole 1: 1(-2.5,0) 2(0,0) 3(2.5,0)
CONN-TH_XH-4A-1
  round 1.75 hole 1.1: 1(-3.75,0) 2(-1.25,0) 3(1.25,0) 4(3.75,0)
FUSE-TH_L24.4-W9.4-P22.60
  round 3 hole 1.8: 1(-11.325,0) 2(11.325,0)
HDR-TH_15P-P2.54-V-F-1
  rect 1.6x1.575 hole 1: 1(-17.78,0)
  round 1.6 hole 1: 2(-15.24,0) 3(-12.7,0) 4(-10.16,0) 5(-7.62,0) 6(-5.08,0) 7(-2.54,0) 8(0,0) 9(2.54,0) 10(5.08,0) 11(7.62,0) 12(10.16,0) 13(12.7,0) 14(15.24,0) 15(17.78,0)
IND-SMD_L10.8-W10.0_SLO1040H
  rect 2.924x3.42 smd: 1(4.778,0) 2(-4.778,0)
MSOP-10_L3.0-W3.0-P0.50-LS5.0-BL
  oval 0.28x1.62 smd: 1(-1,-2.11) 2(-0.5,-2.11) 3(0,-2.11) 4(0.5,-2.11) 5(1,-2.11) 6(1,2.11) 7(0.5,2.11) 8(0,2.11) 9(-0.5,2.11) 10(-1,2.11)
R0402
  rect 0.566x0.54 smd: 1(-0.433,0) 2(0.433,0)
R1206
  rect 1.208x1.701 smd: 1(-1.479,0) 2(1.479,0)
SMA_L4.3-W2.5-LS5.0-RD
  rect 2x1.593 smd: 1(-2.1,0) 2(2.1,0)
SMAF_L3.5-W2.6-LS4.7-FD
  rect 1.7x1.8 smd: 1(-2,0) 2(2,0)
SOT-23-3_L2.9-W1.6-P1.90-LS2.8-BR
  rect 1.07x0.6 smd: 1(1.235,-0.95) 2(1.235,0.95) 3(-1.235,0)
TO-252-2_L6.6-W5.6-P4.60-LS9.7-BR
  rect 2.54x1 smd: 1(3.426,-2.3) 3(3.426,2.3)
  rect 6.2x5.8 smd: 2(-3.426,0)
TO-252-2_L6.6-W6.1-P4.57-LS9.9-BR-CW
  rect 3x1.6 smd: 1(3.424,-2.29) 3(3.424,2.29)
  rect 6.2x5.8 smd: 2(-3.424,0)
TO-263-5_L10.2-W8.9-P1.70-BR
  rect 3.083x1.02 smd: 1(5.16,-3.4) 2(5.16,-1.7) 3(5.16,0) 4(5.16,1.7) 5(5.16,3.4)
  rect 8.5x11 smd: 6(-5.16,0)

## Nets
As in the schematic, except:
3.3V: OLED1.1 Q16.1 Q17.1 R25.2 R26.1 R27.1 U8.15
+5V: C1.1 C2.1 C3.1 FD_LEVEL2.3 FD_PRESS1.3 FP_LEVEL2.3 FP_PRESS1.3 L1.1 R28.1 R29.1 RD_LEVEL2.3 RD_PRESS1.3 RP_LEVEL2.3 RP_PRESS1.3 TANK1.3 U4.8 U5.8 U6.4 U7.15
$1N4374: D2.1 Q2.2 VTB1.6
$1N4429: OLED1.4 Q16.2 R27.2 U8.5
$1N4437: OLED1.3 Q17.2 R26.2 U8.2
$1N4450: Q17.3 R28.2 R33.1 R35.1
$1N4453: Q16.3 R29.2 R34.1 R36.1
$1N4463: D1.1 Q1.2 VTB1.5
$1N4464: D8.1 Q8.2 VTB1.4
$1N4465: D3.1 Q3.2 VTB1.3
$1N4466: D6.1 Q6.2 VTB1.2
$1N4467: D5.1 Q5.2 VTB1.1

Pads without a net: U4 2; U5 2; U7 1 2 3 4 5; U8 3 4 8 10 11 12 13

## Via types
v1: diameter 0.61, hole 0.305, Top Layer to Bottom Layer, 98 vias

## Routing (per net, layer and track width the routed paths; a pad name or vN(x,y) marks a point on that pad's centre or on a via; arc(x,y) is an arc through that point)
3.3V: length 99.3
  Top Layer w0.486: 53.39,63.57 54.39,63.57 57.34,66.52 OLED1.1 ; 53.39,63.57 v1(52.39,64.57) ; 53.39,63.57 53.25,63.57 ; Q17.1 52.39,60.89 v1(51.39,59.89) ; v1(50.39,64.57) v1(50.39,61.57)
  Top Layer w0.54: R25.2 16.34,51.52 v1(16.34,59.32) ; v1(51.39,59.89) 51.39,58.11 Q16.1
  Top Layer w1: v1(18.44,48.42) 18.44,49.42 R25.2
  Bottom Layer w0.486: v1(50.39,61.57) 50.39,60.89 v1(51.39,59.89) ; v1(52.39,64.57) v1(50.39,64.57)
  Bottom Layer w0.54: v1(16.34,59.32) 28.62,71.6 55.34,71.6 OLED1.1
  Bottom Layer w1: U8.15 18.44,41.69 v1(18.44,48.42)
12VACC: length 47
  Top Layer w1: D15.1 30.03,39.88 20.76,39.88 16.76,43.88 R22.2 v1(16.76,46.5)
  Bottom Layer w1: CN1.3 6.67,66.6 6.67,56.6 v1(16.76,46.5)
12VS: length 190.2
  Top Layer w0.918: v1(16.93,17.54) 13.93,17.54 C4.1 ; v1(31.93,16.8) 33.93,16.8 34.77,17.64 U6.1 34.77,19.91 39.77,24.91 42.83,24.91 D4.2
  Top Layer w1: VTA1.1 98.95,30.34 98.95,26.04 ; D3.2 82.02,23.18 82.02,24.04 ; D9.2 13.18,46.14 v1(12.18,46.14) ; v1(41.83,41.91) 41.83,44.24 Q15.3 ; D4.2 46.83,22.91 48.83,24.91 ; 48.83,24.91 49.83,25.91 v1(49.83,33.91) ; 48.83,24.91 51.97,24.91 53.9,22.98 55.9,24.98 61.68,24.98 D5.2 65.63,21.04 71.02,21.04 D6.2 75.02,25.04 79.02,25.04 80.52,23.54 81.52,23.54 82.02,24.04 ; 101.47,23.51 D1.2 ; 101.47,23.51 98.95,26.04 ; 101.47,23.51 102.47,24.51 109.49,24.51 D2.2 ; 82.02,24.04 84.02,24.04 85.02,25.04 89.95,25.04 D8.2 93.95,25.04 97.95,25.04 98.95,26.04
  Bottom Layer w0.918: v1(31.93,16.8) 31.67,16.54 17.93,16.54 v1(16.93,17.54)
  Bottom Layer w1: v1(49.83,33.91) v1(41.83,41.91) ; v1(12.18,46.14) 8.33,42.29 8.33,26.14 v1(16.93,17.54)
+5V: length 251.5
  Top Layer w0.252: U7.15 15.57,64.21 34.57,64.21 42.03,71.67 57.03,71.67 58.03,70.67 59.03,70.67 ; 63.03,57.67 63.03,52.67 62.03,51.67 61.03,51.67 60.71,52 U5.8 ; 63.03,57.67 v1(63.03,58.11) ; 63.03,57.67 66.03,60.67 ; 66.03,60.67 73.03,67.67 73.03,69.67 72.03,70.67 59.03,70.67 ; 66.03,60.67 66.37,60.67 FP_LEVEL2.3 ; 59.03,70.67 59.03,66.67 56.72,64.36 R28.1 ; v1(61.03,59.11) 60.68,59.46 U4.8 ; 56.72,63.36 R29.1
  Top Layer w0.486: R28.1 56.72,63.36
  Top Layer w0.72: 7.29,23.62 12.61,23.62 19.35,16.88 C2.1 22.35,16.88 ; 22.35,16.88 22.35,13.47 C3.1 ; 22.35,16.88 C1.1 24.3,16.92 v1(25.3,17.92) ; v1(29.02,17.64) 29.02,18.98 U6.4
  Top Layer w1: 77.86,68.67 77.86,63.67 ; 77.86,68.67 74.03,68.67 73.03,67.67 ; 77.86,68.67 RD_LEVEL2.3 ; 77.86,63.67 77.86,60.48 FD_LEVEL2.3 ; 77.86,63.67 78.86,64.67 86.86,64.67 89.86,61.67 90.86,61.67 ; 99.33,60.2 99.33,61.2 98.33,62.2 94.33,62.2 92.33,60.2 ; 99.33,60.2 99.33,53.57 TANK1.3 ; 99.33,60.2 FD_PRESS1.3 103.8,68.91 RD_PRESS1.3 ; RP_PRESS1.3 90.86,67.2 90.86,61.67 ; RP_LEVEL2.3 67.03,69.03 67.03,70.67 ; 90.86,61.67 92.33,60.2 ; 7.29,23.62 4.29,26.62 4.29,53.93 9.03,58.67 U7.15 ; 92.33,60.2 FP_PRESS1.3
  Bottom Layer w0.252: v1(63.03,58.11) 62.03,58.11 v1(61.03,59.11)
  Bottom Layer w0.72: v1(29.02,17.64) 28.73,17.92 v1(25.3,17.92)
GND: length 462.1
  Top Layer w0.252: 60.68,65.94 U4.3 ; v1(62.93,61.48) 62.93,59.48 61.93,58.48 60.93,58.48 60.71,58.26 U5.3
  Top Layer w0.486: v1(56.93,53.48) 55.5,52.05 55.5,49.05 49.93,43.48 ; R32.1 56.72,57.69 v1(56.93,57.48) 56.72,57.27 R31.1
  Top Layer w0.72: D14.1 22.35,20.86 22.35,18.28 ; C2.2 22.35,18.28 ; 22.35,18.28 C1.2 24.3,19.32 27.3,19.32 27.62,19.64 U6.5 ; 27.62,17.64 27.62,15.64 22.62,10.64 16.03,10.64 C4.2
  Top Layer w0.9: 20.07,44.77 24.59,44.77 Q11.3 31.86,42.04 32.32,41.58 32.32,40.04 37.32,35.04 40.33,35.04 R37.2 ; Q1.3 96.33,16.6 v1(96.33,15.12) ; 13.57,43.42 10.57,43.42 Q9.3 ; 13.57,43.42 15.57,41.42 15.57,36.27 v1(13.57,34.27) ; 13.57,43.42 13.57,44.04 R18.2 ; v1(93.18,11.27) 94.18,11.27 ; 94.18,11.27 R8.2 ; 94.18,11.27 94.18,8.27 96.18,6.27 102.18,6.27 103.94,8.03 ; 31.37,14.88 37.86,14.88 Q4.3 42.35,19.38 R4.2 47.51,19.38 Q7.3 51.87,19.5 R7.2 58.63,17.5 ; v1(88.33,16.12) Q8.3 85.02,19.44 R3.2 80.19,19.44 77.87,17.11 75.54,19.44 R6.2 70.78,19.44 Q6.3 66.19,19.44 R5.2 61.56,19.44 59.63,17.5 58.63,17.5 ; 103.94,8.03 105.94,6.03 111.94,6.03 113.34,7.43 R2.2 ; 103.94,8.03 R1.2 ; D10.1 30.67,50.37 v1(29.67,49.37) ; Q5.3 58.99,17.14 58.63,17.5 ; Q14.3 49.93,43.48 51.35,42.06 51.35,38.06 49.35,36.06 48.35,36.06 R24.1 ; v1(105.33,18.12) Q2.3
  Top Layer w0.918: U6.6 31.37,14.88 29.62,16.64 ; 29.62,16.64 31.37,18.39 U6.3 ; 29.62,16.64 28.62,16.64 27.62,17.64 27.62,19.64
  Top Layer w1: 21.62,10.64 21.62,8.1 C3.2 ; R24.1 46.18,37.89 R37.2 ; v1(20.67,53.37) 27.67,53.37 30.67,50.37 ; v1(19.22,24.99) 22.22,21.99 D14.1 ; R23.2 v1(20.07,42.77) ; v1(81.38,63.2) 81.38,61.96 FD_LEVEL2.1 90.15,60.2 92.15,58.2 95.75,58.2 v1(96.75,59.2) FP_PRESS1.1
  Bottom Layer w0.252: 60.88,64.48 60.9,64.51 ; 60.88,64.48 60.9,64.48 60.9,64.51 ; 60.88,64.48 59.96,64.48 OLED1.2 ; 60.9,64.51 61,64.61 ; 60.9,64.51 60.9,64.71 ; v1(56.93,57.48) 56.93,59.48 61,63.56 ; 61,63.56 61.22,63.77 62.63,63.77 63.58,62.83 63.58,62.13 v1(62.93,61.48) 65.93,58.48 70.13,58.48 FP_LEVEL2.1 ; 61,63.56 61,64.61 ; 61,64.61 60.9,64.71 ; 60.9,64.71 60.9,65.72 v1(60.68,65.95) 60.68,64.93 60.9,64.71
  Bottom Layer w0.486: v1(56.93,53.48) v1(56.93,57.48)
  Bottom Layer w0.9: v1(105.33,18.12) 102.33,15.12 v1(96.33,15.12) 95.33,15.12 92.33,12.12 ; 92.33,12.12 v1(93.18,11.27) ; 92.33,12.12 v1(88.33,16.12) ; 20.07,41.77 27.07,41.77 31.67,46.37 31.67,47.37 v1(29.67,49.37) ; 12.57,33.27 v1(13.57,34.27)
  Bottom Layer w1: RD_PRESS1.1 108.75,68.96 108.75,60.2 ; v1(20.67,53.37) 17.88,53.37 12.57,58.67 ; 81.38,67.2 v1(81.38,63.2) ; 81.38,67.2 76.84,67.2 75.84,68.2 71.84,68.2 ; 81.38,67.2 RD_LEVEL2.1 ; 102.75,53.2 108.75,59.2 108.75,60.2 ; 102.75,53.2 v1(96.75,59.2) 97.62,60.07 RP_PRESS1.1 ; 102.75,53.2 103.21,52.74 TANK1.1 ; v1(19.22,24.99) 19.22,26.62 12.57,33.27 ; 71.84,68.2 RP_LEVEL2.1 ; 71.84,68.2 FP_LEVEL2.1 ; 108.75,60.2 FD_PRESS1.1 ; OLED1.2 52.84,67.6 44.06,67.6 FH1.2 ; v1(20.07,42.77) 20.07,41.77 19.57,41.27 19.57,40.27 v1(13.57,34.27)
VCC: length 52.4
  Top Layer w1: Q15.2 D10.2 31.29,47.73 R39.1 30.4,46.74 v1(30.17,46.74)
  Bottom Layer w1: CN1.2 8.17,65.6 8.17,57.74 16.17,49.74 24.17,49.74 28.17,45.74 29.17,45.74 v1(30.17,46.74)
ESPD12: length 19.9
  Top Layer w1: D16.1 28.67,46.2 v1(28.67,47.66)
  Bottom Layer w1: v1(28.67,47.66) U7.12
$1N4350: length 5
  Top Layer w0.9: R16.1 93.78,17.12 Q8.1
  Top Layer w1: R16.1 R8.1
$1N4351: length 4.9
  Top Layer w0.9: Q7.1 55.91,17.26 R7.1
  Top Layer w1: R7.1 R15.1
$1N4352: length 4.9
  Top Layer w0.9: Q6.1 74.83,17.14 R6.1
  Top Layer w1: R6.1 R14.1
$1N4353: length 5
  Top Layer w0.9: R5.1 65.44,17.14 Q5.1
  Top Layer w1: R5.1 R13.1
$1N4354: length 4.9
  Top Layer w0.9: 47.23,16.42 46.39,17.26 Q4.1
  Top Layer w1: 47.23,16.42 R12.1
$1N4355: length 4.9
  Top Layer w0.9: 82.47,17.11 84.26,17.11 R3.1
  Top Layer w1: R3.1 R11.1
$1N4356: length 4.8
  Top Layer w0.9: Q2.1 112.56,17.11 R10.1
  Top Layer w1: R10.1 R2.1
$1N4357: length 5
  Top Layer w0.9: Q1.1 103.3,17.12 R9.1
  Top Layer w1: R9.1 R1.1
$1N4371: length 92.4
  Top Layer w1: 42.53,11.01 47.53,6.01 73.53,6.01 v1(76.53,9.01) ; 42.53,11.01 Q4.2 ; 42.53,11.01 v1(42.53,17.01) ; D4.1 v1(40.63,19.91)
  Bottom Layer w1: 102.83,31.73 102.53,31.42 102.53,24.01 99.53,21.01 91.53,21.01 86.53,16.01 86.53,13.01 82.53,9.01 v1(76.53,9.01) ; v1(42.53,17.01) 40.63,18.91 v1(40.63,19.91)
$1N4374: length 40.2
  Top Layer w1: Q2.2 108.75,10.34 108.75,21.02 ; 106.75,23.02 108.75,21.02 ; 108.75,21.02 111.75,21.02 112.75,22.02 112.75,33.81 VTB1.6
$1N4376: length 9.1
  Top Layer w0.9: R17.1 6.43,43.56 Q9.1
  Top Layer w1: R18.1 12.53,40.51 R17.1
$1N4377: length 122
  Top Layer w1: R10.2 114.34,20.28 114.34,34.28 98.34,50.28 57.34,50.28 v1(56.34,51.28)
  Bottom Layer w1: U7.8 31.81,62.67 53.95,62.67 54.95,61.67 54.95,60.67 53.34,59.06 53.34,54.28 v1(56.34,51.28)
$1N4378: length 83.4
  Top Layer w1: R11.2 v1(83.89,12.27) ; v1(54.89,31.27) v1(51.89,34.27)
  Bottom Layer w1: U7.9 27.68,56.27 36.89,56.27 46.89,46.27 46.89,39.27 v1(51.89,34.27) ; v1(83.89,12.27) 64.89,31.27 v1(54.89,31.27)
$1N4379: length 26.4
  Top Layer w1: 8.17,50.46 8.17,53.37 v1(7.17,54.37) ; 8.17,50.46 13.31,50.46 D9.1 ; 8.17,50.46 Q9.2
  Bottom Layer w1: v1(7.17,54.37) 5.17,56.37 5.17,67.6 CN1.4
$1N4380: length 54.8
  Top Layer w1: R13.2 v1(65.1,10.27)
  Bottom Layer w1: v1(65.1,10.27) 63.1,8.27 46.28,8.27 25.27,29.27 U8.9
$1N4381: length 59.9
  Top Layer w1: R14.2 v1(74.5,12.27)
  Bottom Layer w1: 30.35,33.27 30.5,33.13 30.5,26.27 46.5,10.27 55.5,10.27 57.5,12.27 v1(74.5,12.27)
$1N4382: length 57.8
  Top Layer w1: v1(76.94,42.02) 83.94,49.02 v1(97.28,49.02) ; R19.2 v1(49.94,39.02)
  Bottom Layer w1: v1(76.94,42.02) 73.94,39.02 v1(49.94,39.02) ; v1(97.28,49.02) TANK1.2
$1N4383: length 26.7
  Top Layer w1: v1(35.94,54.98) 35.94,55.63 U7.6 ; R19.1 46.94,40.98 ; 46.94,40.98 46.94,44.98 45.94,45.98 v1(44.94,45.98) ; 46.94,40.98 R24.2
  Bottom Layer w1: v1(44.94,45.98) v1(35.94,54.98)
$1N4386: length 6.9
  Bottom Layer w1: FH1.1 19.41,69.6 CN1.1
$1N4403: length 29
  Top Layer w0.252: v1(59.2,60.46) U4.6
  Bottom Layer w0.252: FD_LEVEL2.2 76.65,56.2 58.94,56.2 57.94,57.2 57.94,59.2 v1(59.2,60.46)
$1N4407: length 21.4
  Top Layer w0.252: v1(67.34,64.2) 67.34,65.2 63.86,68.68 61.86,68.68 59.18,66 59.18,63.5 59.43,63.25 59.93,63.25 60.18,63.5 U4.4
  Bottom Layer w0.252: v1(67.34,64.2) 69.34,62.2 FP_LEVEL2.2
$1N4413: length 24.9
  Top Layer w0.252: v1(63.52,67.83) 61.68,67.83 59.68,65.83 U4.5
  Bottom Layer w0.252: v1(63.52,67.83) 66.52,70.83 78.52,70.83 RD_LEVEL2.2
$1N4416: length 54.7
  Top Layer w0.252: v1(58.86,57.36) U5.5
  Bottom Layer w0.252: RD_PRESS1.2 104.2,71.01 91.2,71.01 82.2,62.01 78.2,62.01 73.54,57.36 v1(58.86,57.36)
$1N4423: length 16.4
  Top Layer w0.252: v1(62.97,62.46) 66.97,62.46 69.34,64.83 RP_LEVEL2.2 ; U4.7 60.18,61.46 v1(59.97,61.67)
  Bottom Layer w0.252: v1(59.97,61.67) 61.25,62.96 62.47,62.96 v1(62.97,62.46)
$1N4424: length 51.2
  Top Layer w0.252: v1(59.24,53.14) U5.6 ; FD_PRESS1.2 v1(100.3,54.2)
  Bottom Layer w0.252: v1(59.24,53.14) 60.17,52.2 62.3,52.2 64.3,54.2 v1(100.3,54.2)
$1N4428: length 43.9
  Top Layer w0.252: U5.7 60.21,51.88 60.95,51.14 77.3,51.14 v1(85.12,58.96)
  Bottom Layer w0.252: RP_PRESS1.2 v1(85.12,58.96)
$1N4429: length 51
  Top Layer w0.486: Q16.2 50.59,57.01 50.59,60.45 52.84,62.71 ; 52.84,62.71 R27.2 ; 52.84,62.71 52.55,62.71 51.84,63.41 51.84,64.11 49.84,66.11 OLED1.4
  Top Layer w0.54: 50.59,57.45 47.59,57.45 43.59,53.45 43.59,48.45 41.59,46.45 40.59,46.45 39.59,45.45 39.59,43.45 38.59,42.45 v1(38.59,36.45)
  Bottom Layer w0.54: v1(38.59,36.45) 38.59,36.43 U8.5
$1N4434: length 14.2
  Top Layer w1: Q11.2 21.93,48.89 R25.1 19.4,51.42 19.4,57.88 U7.11
$1N4435: length 23.7
  Top Layer w1: v1(12.52,48.51) 14.52,48.51 15.11,49.1 U7.13 ; R17.2 v1(5.52,41.51)
  Bottom Layer w1: v1(5.52,41.51) v1(12.52,48.51)
$1N4436: length 54.6
  Top Layer w1: 45.59,33.27 46.43,32.44 v1(48.42,32.44) ; v1(89.42,22.44) 92.42,19.44 R16.2
  Bottom Layer w1: v1(48.42,32.44) 79.42,32.44 v1(89.42,22.44)
$1N4437: length 49.3
  Top Layer w0.486: v1(54.39,65.55) 52.34,67.6 OLED1.3 ; v1(55.39,63.55) 55.39,62.87 55.23,62.71 R26.2 v1(53.39,61.71) ; Q17.2 52.39,59.21 v1(52.39,59.71)
  Top Layer w0.54: v1(55.39,44.71) 55.39,40.84 49.68,35.12 44.9,35.12 U8.2
  Bottom Layer w0.486: v1(52.39,59.71) 53.39,60.71 v1(53.39,61.71) ; v1(54.39,65.55) 54.39,64.55 v1(55.39,63.55)
  Bottom Layer w0.54: v1(55.39,44.71) 52.39,47.71 v1(52.39,59.71)
$1N4438: length 96.6
  Top Layer w1: v1(98.94,22.44) 99.94,21.44 101.94,21.44 R9.2
  Bottom Layer w1: 30.35,58.67 32.11,60.44 46.94,60.44 47.94,59.44 47.94,50.44 54.94,43.44 77.94,43.44 v1(98.94,22.44)
$1N4442: length 34.6
  Top Layer w1: v1(46.63,24.34) 39.63,31.34 34.83,31.34 U8.6 ; 56.63,11.34 v1(55.63,12.34)
  Bottom Layer w1: v1(46.63,24.34) 46.63,21.34 v1(55.63,12.34)
$1N4443: length 38.8
  Top Layer w0.252: v1(60.21,55.56) U5.4
  Bottom Layer w0.252: FP_PRESS1.2 90.61,55.56 v1(60.21,55.56)
$1N4444: length 7.3
  Top Layer w0.252: U5.1 61.71,55.02 61.58,54.9 59.58,54.9 R31.2
$1N4446: length 9
  Top Layer w0.252: v1(61.96,62.17) 61.68,62.45 U4.1 ; R32.2 v1(58.58,58.17)
  Bottom Layer w0.252: v1(61.96,62.17) 61.96,61.55 v1(58.58,58.17)
$1N4448: length 6.2
  Top Layer w0.252: R33.2 v1(58.58,54.63) ; v1(62.22,53.63) U5.10
  Bottom Layer w0.252: v1(62.22,53.63) 61.22,54.63 v1(58.58,54.63)
$1N4449: length 6.8
  Top Layer w0.252: U4.9 61.18,61.59 60.51,62.26 59.39,62.26 59.39,61.92 59.38,61.91 59.38,61.67 58.58,60.87 58.58,60.56 57.58,59.56 R34.2
$1N4450: length 17.3
  Top Layer w0.486: R35.1 55.96,59.94 Q17.3 v1(55.08,58.94) ; v1(58.58,63.44) 57.77,63.44 R28.2 ; R33.1 55.72,54.63 v1(55.08,54.63)
  Bottom Layer w0.486: v1(58.58,63.44) 56.08,60.94 56.08,58.94 ; 56.08,58.94 56.08,58.63 55.08,57.63 v1(55.08,54.63) ; 56.08,58.94 v1(55.08,58.94)
$1N4451: length 6.8
  Top Layer w0.252: R35.2 57.92,60.71 59.03,61.82 59.03,62.06 59.04,62.07 59.04,62.4 59.25,62.61 60.66,62.61 61.6,61.67 61.6,60.54 U4.10
$1N4452: length 5.4
  Top Layer w0.252: U5.9 61.21,54.14 60.99,54.36 59.43,54.36 58.58,53.51 58.43,53.51 R36.2
$1N4453: length 19.4
  Top Layer w0.486: 54.72,56.44 55.72,57.44 55.72,58.44 R34.1 ; 54.72,56.44 54.72,56.31 Q16.3 54.06,54.96 54.06,54.36 55.06,53.36 55.72,53.36 R36.1 ; 54.72,56.44 53.72,57.44 53.72,60.49 54.72,61.49 57.35,61.49 57.58,61.72 R29.2
$1N4455: length 11
  Top Layer w0.9: v1(20.07,46.69) R23.1 ; Q11.1 v1(21.72,43.04)
  Top Layer w1: R22.1 17.07,47.83 18.07,46.83 19.07,46.83 R23.1
  Bottom Layer w0.9: v1(20.07,46.69) 21.72,45.04 v1(21.72,43.04)
$1N4460: length 60
  Top Layer w1: 47.23,11.34 v1(46.23,12.34)
  Bottom Layer w1: U7.10 47.23,34.18 47.23,27.34 44.23,24.34 44.23,14.34 v1(46.23,12.34)
$1N4462: length 22.1
  Top Layer w0.918: D14.2 29.22,24.99 33.07,21.14 U6.2
  Top Layer w1: D14.2 20.22,26.99 19.22,26.99 16.84,24.61 L1.2
$1N4463: length 41
  Top Layer w1: D1.1 97.27,21.04 99.16,19.15 ; v1(101.16,20.15) 100.16,19.15 99.16,19.15 ; 99.16,19.15 Q1.2
  Bottom Layer w1: v1(101.16,20.15) 106.94,25.93 106.94,37.12 VTB1.5
$1N4464: length 39.1
  Top Layer w1: Q8.2 89.63,20.15 v1(88.75,21.04) 87.75,22.04 D8.1 ; VTB1.4 92.75,33.43 v1(92.75,26.04)
  Bottom Layer w1: v1(88.75,21.04) 89.75,21.04 92.75,24.04 v1(92.75,26.04)
$1N4465: length 42.6
  Top Layer w1: D3.1 78.97,22.04 v1(78.97,20.04) ; VTB1.3 83.97,27.15 v1(83.97,26.04) ; v1(80.17,17.83) Q3.2
  Bottom Layer w1: v1(83.97,26.04) 78.97,21.04 v1(78.97,20.04) 78.97,19.04 v1(80.17,17.83)
$1N4466: length 47.7
  Top Layer w1: v1(70.78,17.04) Q6.2 ; D6.1 v1(70.78,23.04) 70.78,24.04 85.78,39.04 93.78,39.04 95.44,40.69 VTB1.2
  Bottom Layer w1: v1(70.78,23.04) v1(70.78,17.04)
$1N4467: length 54.3
  Top Layer w1: D5.1 59.43,21.04 v1(60.43,20.04) ; VTB1.1 85.29,41.12 v1(69.31,25.15) ; v1(61.31,17.15) Q5.2
  Bottom Layer w1: v1(60.43,20.04) 61.31,19.15 ; 61.31,19.15 63.31,19.15 v1(69.31,25.15) ; 61.31,19.15 v1(61.31,17.15)
$1N4475: length 13.7
  Top Layer w1: R40.1 40.62,40.67 v1(40.62,42.67) ; Q14.2 43.62,46.67 v1(43.62,44.67)
  Bottom Layer w1: v1(43.62,44.67) 42.62,44.67 v1(40.62,42.67)
$1N4476: length 8.5
  Top Layer w1: R39.2 37.42,44.45 Q15.1 37.46,40.56 R40.2
$1N4478: length 7.7
  Top Layer w0.9: Q14.1 45.32,42.99 R37.1
  Top Layer w1: R37.1 43.18,40.81 R38.1
$1N4479: length 7.3
  Top Layer w1: D16.2 D15.2 35.1,40.51 R38.2
$1N4481: length 79.9
  Top Layer w1: D7.1 49.7,20.98 v1(50.7,19.98) ; v1(82.45,40.73) 70.7,28.98 v1(64.7,28.98) ; v1(51.93,17.75) Q7.2
  Bottom Layer w1: VTA1.3 103.33,33.73 89.45,33.73 v1(82.45,40.73) ; v1(51.93,17.75) 51.7,17.98 51.7,18.98 ; v1(50.7,19.98) 51.7,18.98 ; 51.7,18.98 54.7,18.98 v1(64.7,28.98)

## Copper pours and planes (outline as drawn; the poured copper is in the pictures)
GND on Top Layer: -3.43,77.6 120.65,77.6 120.65,-3.18 -3.43,-3.18
GND on Bottom Layer: -2.79,77.22 119.51,77.22 119.51,-1.91 -2.79,-1.91

## Text on the board
Bottom Silkscreen Layer: Bw - Improvements / PsychePone - information / slewedsilver - information | Paspartuu - esp32 board design / AJBugMan - nano board design / gopro_2027 - nano & esp32 board design / WhiskyTngo - SMD Board Conversion | PCB Design Contibutors to OAS-Man: | OAS-Man (Open Source Air Suspension Management) / GNU GPL v3.0 | PCB Design Contibutors to OAS-Man: / Paspartuu - esp32 board design / AJBugMan - nano board design / gopro_2027 - nano & esp32 board design / WhiskyTngo - SMD Board Conversion / Bw - Improvements / PsychePone - information / slewedsilver - information
Top Silkscreen Layer: Left Hand Drive Designation / F = Front, R = Rear / D = Driver (Left), P = Passenger (Right) / I = In (Air Up), O = Out (Air Down) | 5X20 FUSE 3A | RP | FP | RD | FD | TANK | GND | 5V | SIG | Valve Control Output / Constant 12V - Negative Trigger | Level Sense | Pressure Sense | 12V ACC | 12V BATT | SDA | SCL | 3v3 | I/O  12V | DISPLAY / I2C | 15 | 30 | 16 | 1 | RDO | RDI | FDI | RPI | SW / 12V | FDO | FPI | RPO | FPO | COMPRESSOR | USB
